# Altium project drive.PrjPCB
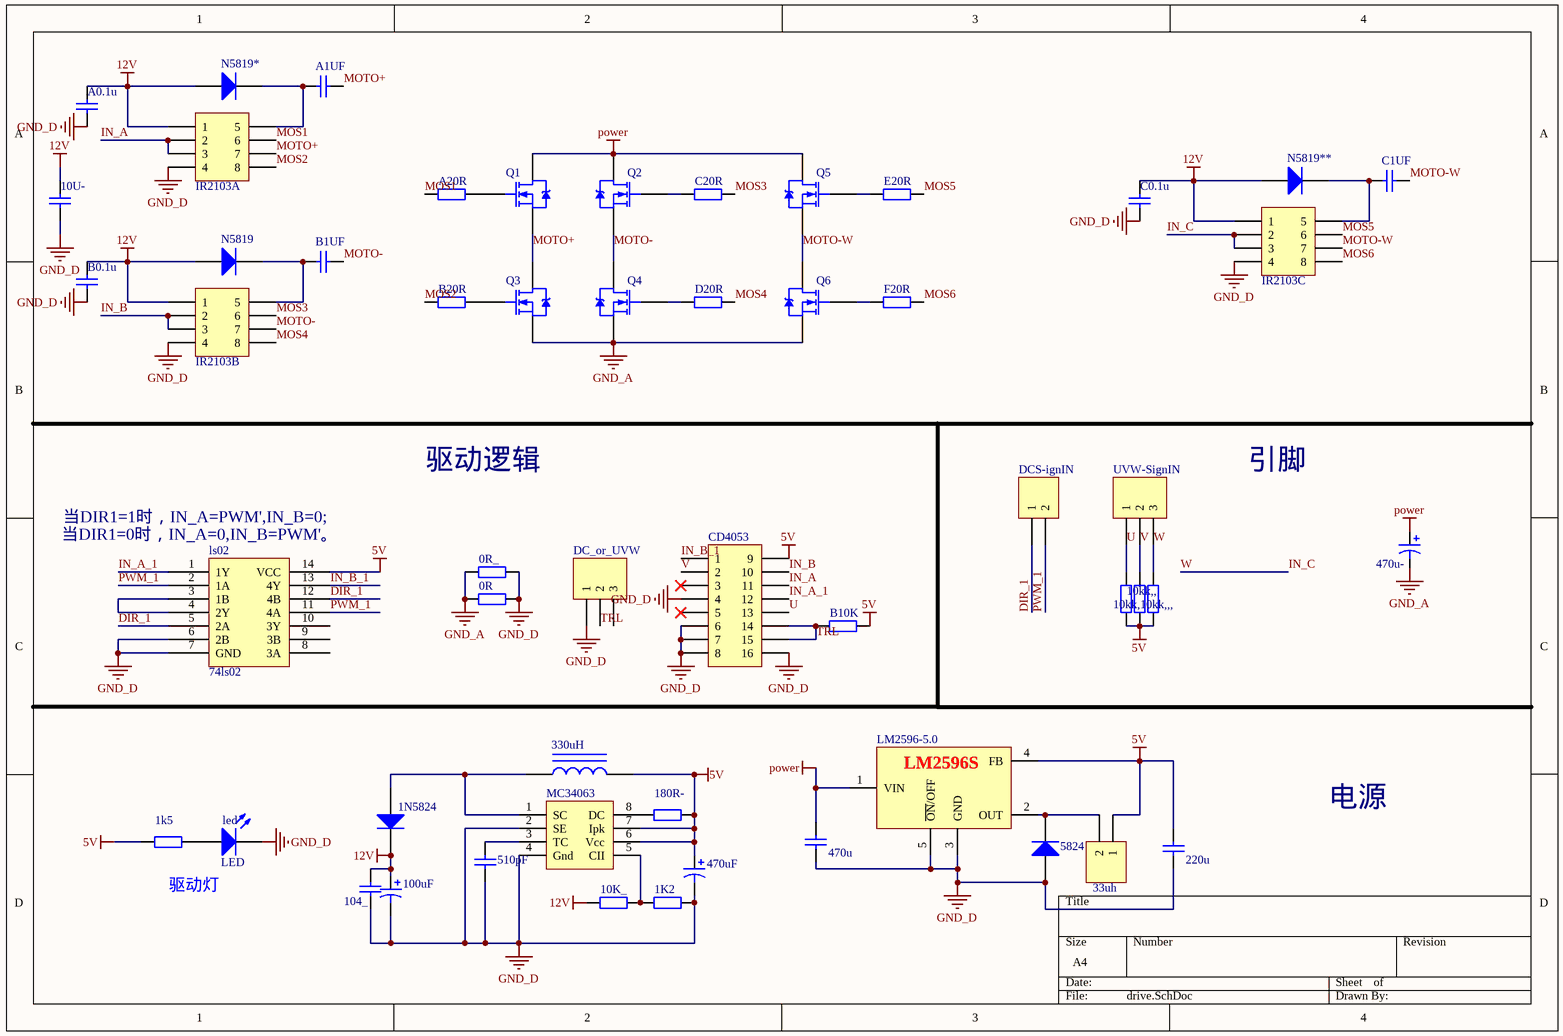
[diagram p0: drive.SchDoc]
1 sheet, 54 parts. Net scope: global (net labels, ports and power ports of the same name join across sheets).
Board file: drive.PcbDoc

## Sheet drive.SchDoc
size A4

### Parts
0R  Res2  [0805]  (value not drawn)
0R_  Res2  [0805]  (value not drawn)
1K2  1K2  [0805]  (value not drawn)
1k5  1K5  [0805]  (value not drawn)
1N5824  1N5819  [DIODE-SMA]  (value not drawn)
10K_  10K  [0805]  (value not drawn)
10kk,  R4  [0805]  (value not drawn)
10kk,,  R4  [0805]  (value not drawn)
10kk,,,  R4  [0805]  (value not drawn)
10U-  0.1u2  [0805]  (value not drawn)
33uh  Header 2  [HDR1X2]  (value not drawn)
100uF  100uF/25V/C  [capso_8*10]  (value not drawn)
104_  0.1u2  [0805]  (value not drawn)
180R-  180R  [0805]  (value not drawn)
220u  Cap  [capso_8*10]  (value not drawn)
330uH  330uH  [L-SMD-12]  (value not drawn)
470u  Cap  [capso_8*10]  (value not drawn)
470u-  CAP 220  [capso_8*10]  (value not drawn)
470uF  470uF/25V/D  [capso_8*10]  (value not drawn)
510pF  510pF  [0805]  (value not drawn)
5824  Diode  [DIODE-SMA]  (value not drawn)
A0.1u  0.1u2  [0805]  (value not drawn)
A1UF  0.1u2  [0805]  (value not drawn)
A20R  R1  [0805]  (value not drawn)
B0.1u  0.1u2  [0805]  (value not drawn)
B1UF  0.1u2  [0805]  (value not drawn)
B10K  Res2  [0805]  (value not drawn)
B20R  R3  [0805]  (value not drawn)
C0.1u  0.1u2  [0805]  (value not drawn)
C1UF  0.1u2  [0805]  (value not drawn)
C20R  R2  [0805]  (value not drawn)
CD4053  Header 8X2A  [SOP16]  (value not drawn)
D20R  R4  [0805]  (value not drawn)
DC_or_UVW  MHDR1X3  [MHDR1X3]  (value not drawn)
DCS-ignIN  Header 2  [HDR1X2]  (value not drawn)
E20R  R2  [0805]  (value not drawn)
F20R  R4  [0805]  (value not drawn)
IR2103A  Header 4X2A  [SOP8]  (value not drawn)
IR2103B  Header 4X2A  [SOP8]  (value not drawn)
IR2103C  Header 4X2A  [SOP8]  (value not drawn)
led  LED  [LED_0805]
LM2596-5.0  LM2596S  [TO-263-5]  (value not drawn)
ls02  74ls02  [SO-14]
MC34063  MC34063  [SOP8]  (value not drawn)
N5819  1N5819  [D1206]  (value not drawn)
N5819*  1N5819  [D1206]  (value not drawn)
N5819**  1N5819  [D1206]  (value not drawn)
Q1  LR7843  [TO-263]  (value not drawn)
Q2  LR7843  [TO-263]  (value not drawn)
Q3  LR7843  [TO-263]  (value not drawn)
Q4  LR7843  [TO-263]  (value not drawn)
Q5  LR7843  [TO-263]  (value not drawn)
Q6  LR7843  [TO-263]  (value not drawn)
UVW-SignIN  Header 3  [HDR1X3]  (value not drawn)

### Nets
5V: 1k5.1 10kk,.2 10kk,,.1 10kk,,,.1 33uh.1 180R-.2 220u.1 330uH.2 470uF.1 B10K.2 CD4053.9 LM2596-5.0.4(FB) ls02.14(VCC) MC34063.6(Vcc) MC34063.7(Ipk)
12V: 1N5824.2(K) 10K_.1 10U-.1 100uF.1 104_.1 A0.1u.1 B0.1u.1 C0.1u.1 IR2103A.1 IR2103B.1 IR2103C.1 N5819.1(A) N5819*.1(A) N5819**.1(A)
GND_A: 0R.2 0R_.2 470u-.2 Q3.3(S) Q4.3(S) Q6.3(S)
GND_D: 0R.1 0R_.1 1K2.2 10U-.2 100uF.2 104_.2 220u.2 470u.2 470uF.2 510pF.1 5824.1(A) A0.1u.2 B0.1u.2 C0.1u.2 CD4053.4 CD4053.6 CD4053.7 CD4053.8 CD4053.16 DC_or_UVW.1 IR2103A.4 IR2103B.4 IR2103C.4 led.2(K) LM2596-5.0.3(GND) LM2596-5.0.5(~{ON}/OFF) ls02.6(2B) ls02.7(GND) MC34063.2(SE) MC34063.4(Gnd)
power: 470u.1 470u-.1 LM2596-5.0.1(VIN) Q1.2(D) Q2.2(D) Q5.2(D)
DIR_1: DCS-ignIN.1 ls02.5(2A) ls02.12(4B)
IN_A: CD4053.11 IR2103A.2 IR2103A.3
IN_A_1: CD4053.12 ls02.1(1Y)
IN_B: CD4053.10 IR2103B.2 IR2103B.3
IN_B_1: CD4053.1 ls02.13(4Y)
IN_C: 10kk,,,.2 IR2103C.2 IR2103C.3 UVW-SignIN.3  [also labelled W]
MOS1: A20R.1 IR2103A.6
MOS2: B20R.1 IR2103A.8
MOS3: C20R.2 IR2103B.6
MOS4: D20R.2 IR2103B.8
MOS5: E20R.2 IR2103C.6
MOS6: F20R.2 IR2103C.8
MOTO+: A1UF.1 IR2103A.7 Q1.3(S) Q3.2(D)
MOTO-: B1UF.1 IR2103B.7 Q2.3(S) Q4.2(D)
MOTO-W: C1UF.1 IR2103C.7 Q5.3(S) Q6.2(D)
PWM_1: DCS-ignIN.2 ls02.2(1A) ls02.11(4A)
TRL: B10K.1 CD4053.14 CD4053.15 DC_or_UVW.2
U: 10kk,.1 CD4053.13 UVW-SignIN.1
V: 10kk,,.2 CD4053.2 UVW-SignIN.2
Net1K2_1: 1K2.1 10K_.2 MC34063.5(CII)
Net1k5_2: 1k5.2 led.1(A)
Net1N5824_1: 1N5824.1(A) 330uH.1 MC34063.1(SC)
Net33uh_2: 33uh.2 5824.2(K) LM2596-5.0.2(OUT)
Net180R-_1: 180R-.1 MC34063.8(DC)
Net510pF_2: 510pF.2 MC34063.3(TC)
NetA1UF_2: A1UF.2 IR2103A.5 N5819*.2(K)
NetA20R_2: A20R.2 Q1.1(G)
NetB1UF_2: B1UF.2 IR2103B.5 N5819.2(K)
NetB20R_2: B20R.2 Q3.1(G)
NetC1UF_2: C1UF.2 IR2103C.5 N5819**.2(K)
NetC20R_1: C20R.1 Q2.1(G)
NetD20R_1: D20R.1 Q4.1(G)
NetE20R_1: E20R.1 Q5.1(G)
NetF20R_1: F20R.1 Q6.1(G)
Netls02_3: ls02.3(1B) ls02.4(2Y)

Not connected (* = marked no-connect by the designer): CD4053 3* 5*; DC_or_UVW 3; ls02 8(3A) 9(3B) 10(3Y)

### Notes on the sheet
- 驱动逻辑
- 引脚
- (near ls02) 当DIR1=0时，IN_A=0,IN_B=PWM'。
- (near ls02) 当DIR1=1时，IN_A=PWM',IN_B=0;
- 电源
- 驱动灯

### Library data of the parts
0R 0R_ B10K = Res2: Resistor; Value: 0R; Published: 8-Jun-2000; LatestRevisionDate: 17-Jul-2002; LatestRevisionNote: Re-released for DXP Platform.; PackageReference: AXIAL-0.4; Publisher: Altium Limited
1K2 10K_ 180R- = Res2: Resistor; Value: 1K; Published: 8-Jun-2000; LatestRevisionDate: 17-Jul-2002; LatestRevisionNote: Re-released for DXP Platform.; PackageReference: AXIAL-0.4; Publisher: Altium Limited; PackageDescription: Axial Device, Thru-Hole; 2 Leads; 0.4 in Pin Spacing
1k5 = RES
1N5824 = Diode 1N4007: 1 Amp General Purpose Rectifier; Published: 8-Jun-2000; LatestRevisionDate: 17-Jul-2002; LatestRevisionNote: Re-released for DXP Platform.; DatasheetVersion: 1998; PackageVersion: Aug-1999; PackageReference: DO-41; Publisher: Altium Limited; PackageDescription: Diode, Axial; Body 5.2 x 2.7 mm (LxDia. max), Lead Dia. 0.86 mm (max); Code_JEDEC: DO-204-AL; ComponentLink1Description: Manufacturer Link; ComponentLink1URL: http://www.fairchildsemi.com/; ComponentLink2Description: Datasheet; ComponentLink2URL: http://www.fairchildsemi.com/ds/1N%2F1N4001.pdf
10kk, 10kk,, 10kk,,, A20R B20R C20R D20R E20R F20R = Res2: Resistor; Value: 4.7R; Published: 8-Jun-2000; LatestRevisionDate: 17-Jul-2002; LatestRevisionNote: Re-released for DXP Platform.; PackageReference: AXIAL-0.4; Publisher: Altium Limited
10U- 104_ A0.1u A1UF B0.1u B1UF C0.1u C1UF = Cap: Capacitor; Value: 0.1uF; Published: 8-Jun-2000; LatestRevisionDate: 17-Jul-2002; LatestRevisionNote: Re-released for DXP Platform.; PackageReference: RAD-0.3; Publisher: Altium Limited
33uh DCS-ignIN = Header 2: Header, 2-Pin; LatestRevisionDate: 17-Jul-2002; LatestRevisionNote: Re-released for DXP Platform.; Publisher: Altium Limited
100uF 470uF = Cap Pol1: Polarized Capacitor (Radial); Value: 100pF; Published: 8-Jun-2000; LatestRevisionDate: 17-Jul-2002; LatestRevisionNote: Re-released for DXP Platform.; PackageReference: RB7.6-15; Publisher: Altium Limited; PackageDescription: Polarized Capacitor (Radial); 2 Leads
220u 470u = Cap: 无极性电容; Value: 100nF; Published: 8-Jun-2000; LatestRevisionDate: 17-Jul-2002; LatestRevisionNote: Re-released for DXP Platform.; PackageReference: RAD-0.3; Publisher: Altium Limited
330uH = Inductor Iron: Magnetic-Core Inductor; Value: 10mH; Published: 24-Mar-1999; LatestRevisionDate: 17-Jul-2002; LatestRevisionNote: Re-released for DXP Platform.; PackageReference: AXIAL-0.9; Publisher: Altium Limited; PackageDescription: Axial Device, Thru-Hole; 2 Leads; 0.9 in Pin Spacing
470u- = CAP+
510pF = Cap: Capacitor; Value: 100pF; Published: 8-Jun-2000; LatestRevisionDate: 17-Jul-2002; LatestRevisionNote: Re-released for DXP Platform.; PackageReference: RAD-0.3; Publisher: Altium Limited; PackageDescription: Radial Cap, Thru-Hole; 2 Leads; 0.3 in Pin Spacing
5824 = Diode: Default Diode; Published: 8-Jun-2000; LatestRevisionDate: 17-Jul-2002; LatestRevisionNote: Re-released for DXP Platform.; PackageVersion: Sep-1996; PackageReference: SMC; Publisher: Altium Limited; PackageDescription: DO-214-AB/SMC; 2 C-Bend Leads; Body 7.9 x 5.9 mm, inc. leads (LxW); Code_JEDEC: DO-214-AB
CD4053 = Header 8X2A: Header, 8-Pin, Dual row; pin to pad: 9>16 10>15 11>14 12>13 13>12 14>11 15>10 16>9; LatestRevisionDate: 17-Jul-2002; LatestRevisionNote: Re-released for DXP Platform.; Publisher: Altium Limited
DC_or_UVW = MHDR1X3: Header, 3-Pin; LatestRevisionDate: 17-Jul-2002; LatestRevisionNote: Re-released for DXP Platform.; Publisher: Altium Limited
IR2103A IR2103B IR2103C = Header 4X2A: Header, 4-Pin, Dual row; pin to pad: 5>8 6>7 7>6 8>5; LatestRevisionDate: 17-Jul-2002; LatestRevisionNote: Re-released for DXP Platform.; Publisher: Altium Limited
LM2596-5.0 = LM2596S: NS SIMPLE SWITCHER?Power Converter 150 kHz
MC34063 = Component_1
N5819 N5819* N5819** = Diode 1N4934: 1 Amp Fast Recovery Rectifier; Published: 8-Jun-2000; LatestRevisionDate: 17-Jul-2002; LatestRevisionNote: Re-released for DXP Platform.; DatasheetDocument: 1999; PackageDocument: Aug-1999; PackageReference: DO-41; Publisher: Altium Limited; Code_JEDEC: DO-204-AL; ComponentLink1Description: Manufacturer Link; ComponentLink1URL: http://www.fairchildsemi.com/; ComponentLink2Description: Datasheet; ComponentLink2URL: http://www.fairchildsemi.com/ds/1N%2F1N4934.pdf
Q1-Q6 = NMOS-2: N-Channel Power MOSFET; pin to pad: 2>4; Note: Pin 2 is electrically connected to pin 4.; Published: 8-Jun-2000; LatestRevisionDate: 17-Jul-2002; LatestRevisionNote: Re-released for DXP Platform.; DatasheetDocument: PD-9.814; PackageReference: TO-220AB; Publisher: Altium Limited; Code_JEDEC: TO-220-AB; ComponentLink1Description: Manufacturer Link; ComponentLink1URL: http://www.irf.com/
UVW-SignIN = Header 3: Header, 3-Pin; LatestRevisionDate: 17-Jul-2002; LatestRevisionNote: Re-released for DXP Platform.; Publisher: Altium Limited